# EAGLE design Xadow-NFC-v2 (EAGLE 6.4)
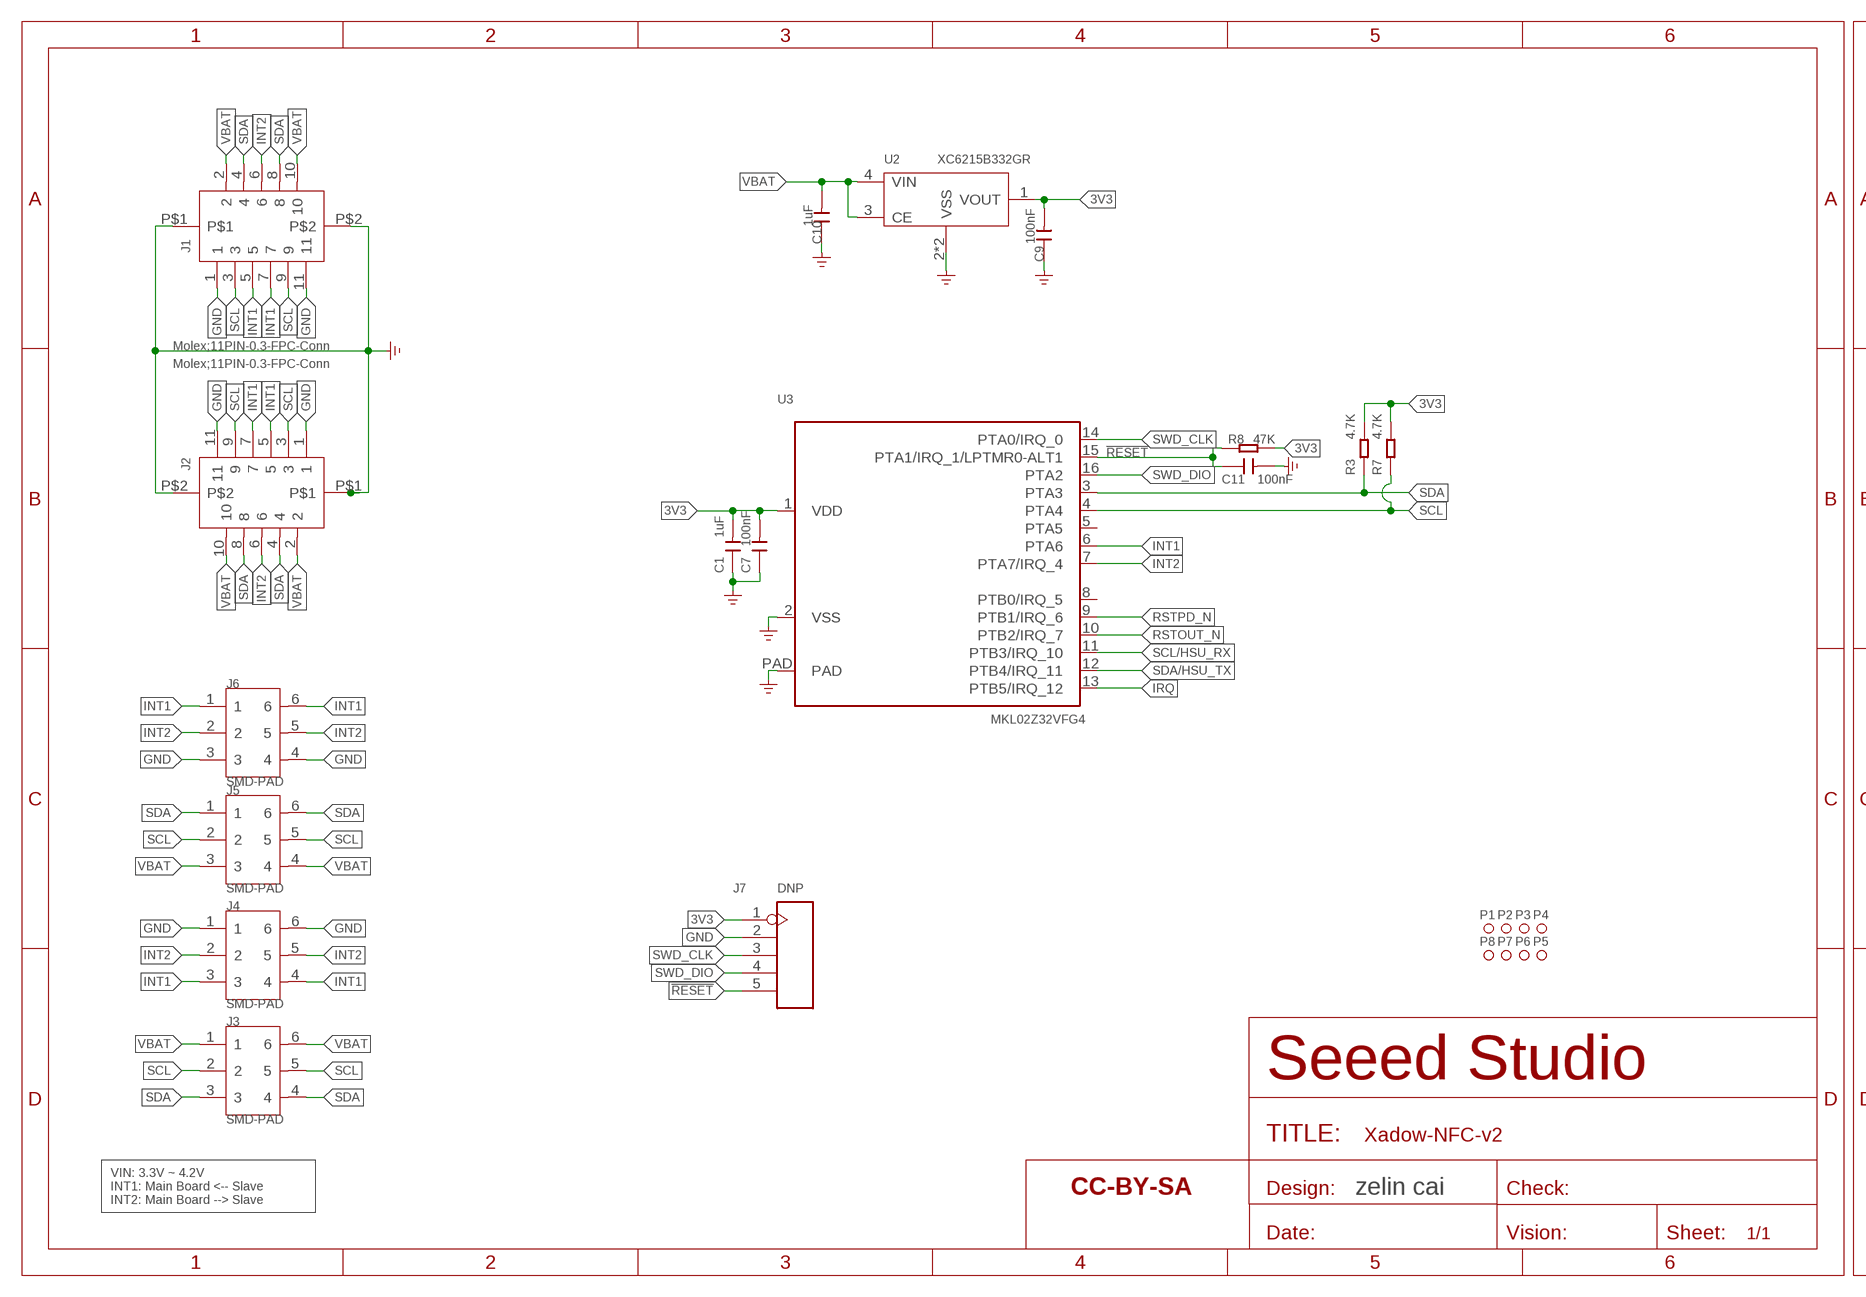
[diagram p0: schematic, sheet 1, part 1 of 2]
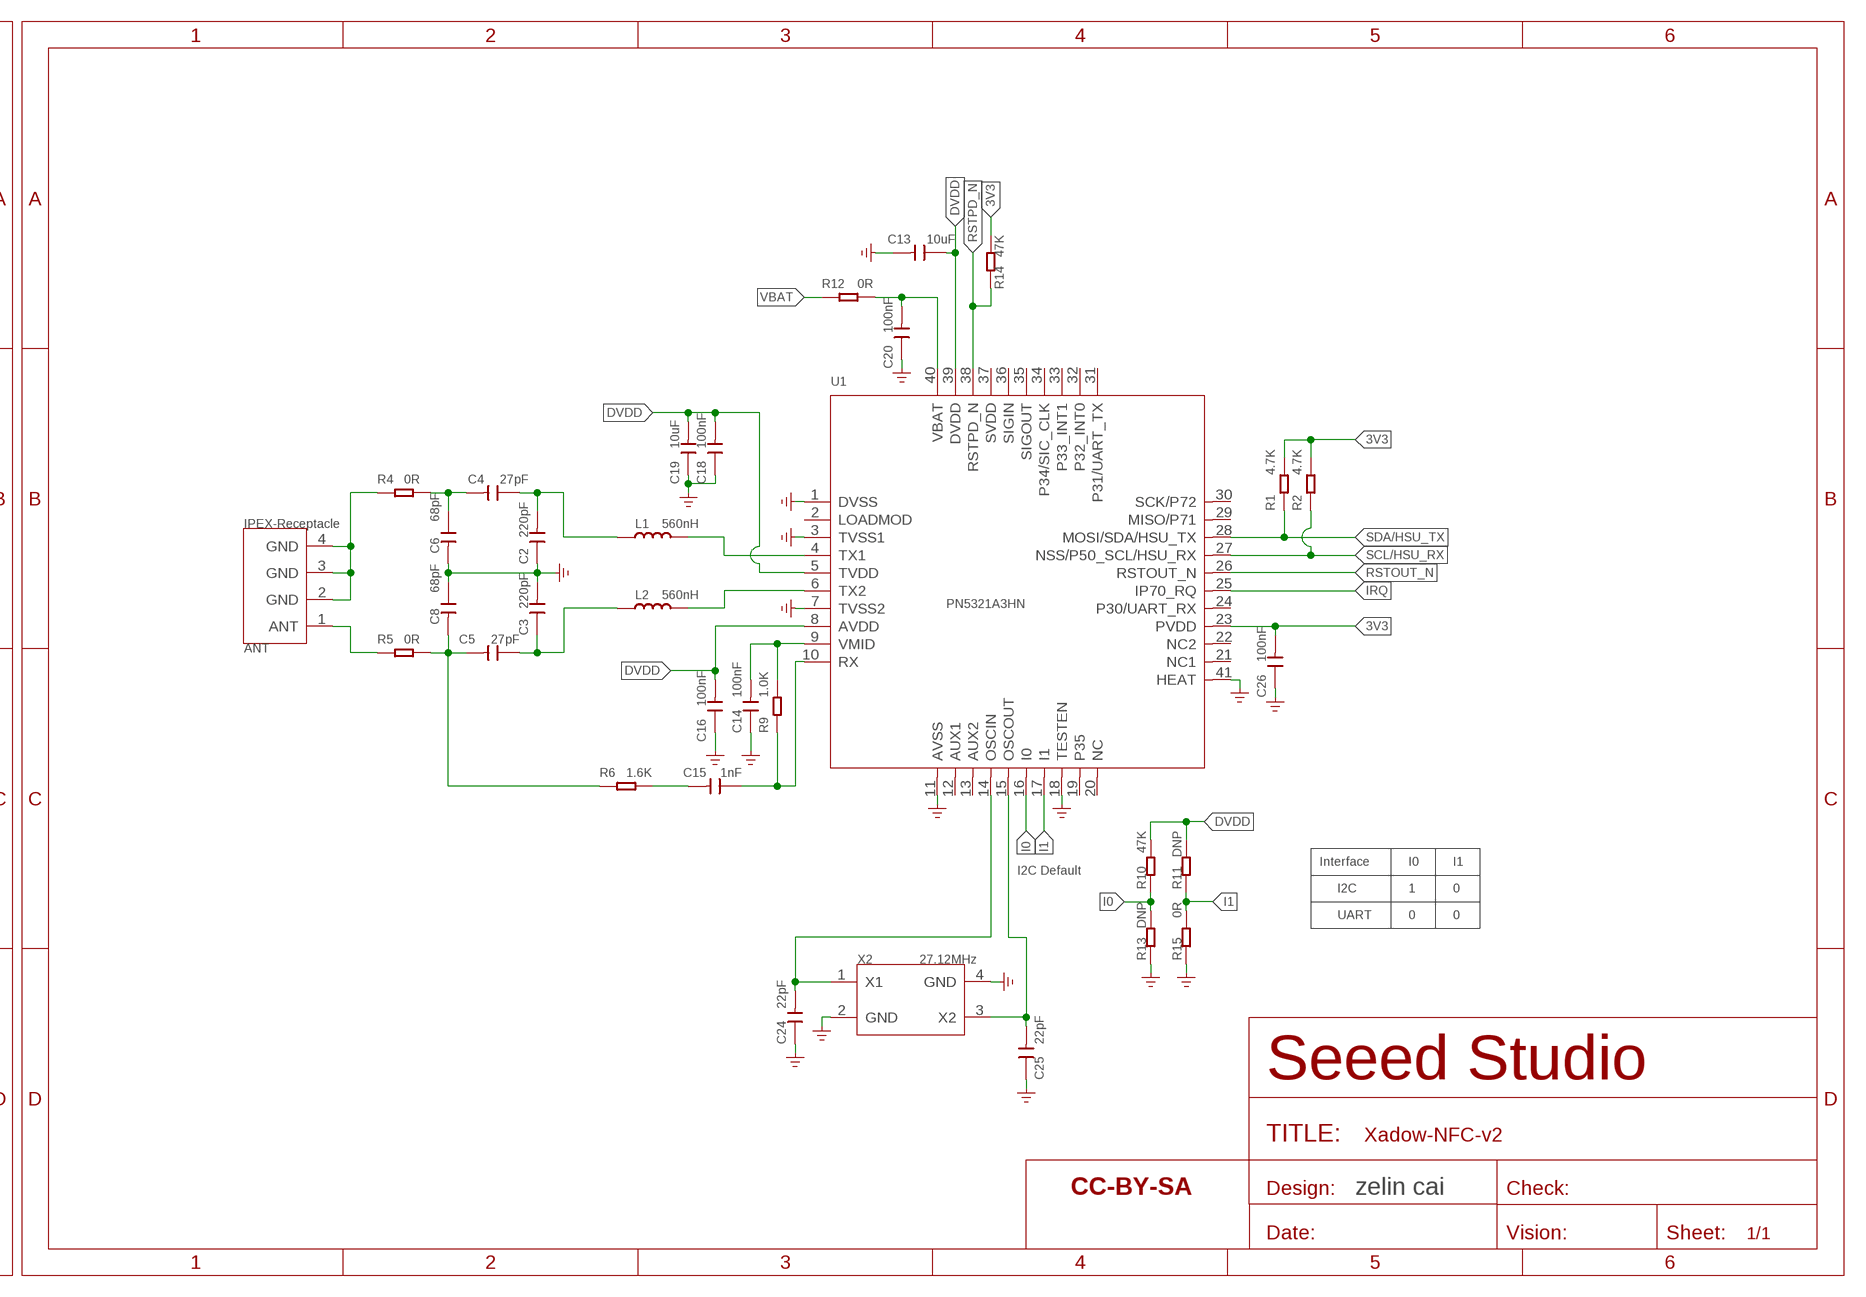
[diagram p1: schematic, sheet 1, part 2 of 2]

## Parts
ANT  IPEX-Receptacle  ANT_IPEX  [ANT-IPEX4-1.7X1.7MM]
C1  1uF  CAP-0402  [C0402]
C2  220pF  CAP-0402  [C0402]
C3  220pF  CAP-0402  [C0402]
C4  27pF  CAP-0402  [C0402]
C5  27pF  CAP-0402  [C0402]
C6  68pF  CAP-0402  [C0402]
C7  100nF  CAP-0402  [C0402]
C8  68pF  CAP-0402  [C0402]
C9  100nF  CAP-0402  [C0402]
C10  1uF  CAP-0402  [C0402]
C11  100nF  CAP-0402  [C0402]
C13  10uF  CAP-0402  [C0402]
C14  100nF  CAP-0402  [C0402]
C15  1nF  CAP-0402  [C0402]
C16  100nF  CAP-0402  [C0402]
C18  100nF  CAP-0402  [C0402]
C19  10uF  CAP-0402  [C0402]
C20  100nF  CAP-0402  [C0402]
C24  22pF  CAP-0402  [C0402]
C25  22pF  CAP-0402  [C0402]
C26  100nF  CAP-0402  [C0402]
J1  Molex;11PIN-0.3-FPC-Conn  FPC-CONNECTER-11P(FH35C-11S-0.3SHW(50))  [FPC11-SMD-0.3(FH35C)]
J2  Molex;11PIN-0.3-FPC-Conn  FPC-CONNECTER-11P(FH35C-11S-0.3SHW(50))  [FPC11-SMD-0.3(FH35C)]
J3  SMD-PAD  HEADER6_S3  [6P-DIP-2_S3]
J4  SMD-PAD  HEADER6_ROUND  [6P-DIP-2_ROUND]
J5  SMD-PAD  HEADER6  [6P-DIP-2]
J6  SMD-PAD  HEADER6_ROUND  [6P-DIP-2_ROUND]
J7  DNP  HEADER-5P'TEST'  [H5-SMD-2.0-TEST]
L1  560nH  INDUCTOR/FERRITE-BEAD'0603'  [L0603]
L2  560nH  INDUCTOR/FERRITE-BEAD'0603'  [L0603]
P1  MRK  MARK-1.0'ANNULAR'  [ROUND-MARK-1.0]
P2  MRK  MARK-1.0'ANNULAR'  [ROUND-MARK-1.0]
P3  MRK  MARK-1.0'ANNULAR'  [ROUND-MARK-1.0]
P4  MRK  MARK-1.0'ANNULAR'  [ROUND-MARK-1.0]
P5  MRK  MARK-1.0'ANNULAR'  [ROUND-MARK-1.0]
P6  MRK  MARK-1.0'ANNULAR'  [ROUND-MARK-1.0]
P7  MRK  MARK-1.0'ANNULAR'  [ROUND-MARK-1.0]
P8  MRK  MARK-1.0'ANNULAR'  [ROUND-MARK-1.0]
R1  4.7K  RES-0402  [R0402]
R2  4.7K  RES-0402  [R0402]
R3  4.7K  RES-0402  [R0402]
R4  0R  RES-0402  [R0402]
R5  0R  RES-0402  [R0402]
R6  1.6K  RES-0402  [R0402]
R7  4.7K  RES-0402  [R0402]
R8  47K  RES-0402  [R0402]
R9  1.0K  RES-0402  [R0402]
R10  47K  RES-0402  [R0402]
R11  DNP  RES-0402  [R0402]
R12  0R  RES-0402  [R0402]
R13  DNP  RES-0402  [R0402]
R14  47K  RES-0402  [R0402]
R15  0R  RES-0402  [R0402]
U1  PN5321A3HN  RF-PN5321A3HN/C106,55  [QFN40G-0.5-6X6MM]
U2  XC6215B332GR  PMIC-XC6215-3V3  [USP4-0.6-1.2X1.6MM]
U3  MKL02Z32VFG4  CONTROLLER-MKL02ZXXVFG4  [QFN16G-0.5-3X3MM]
U$1  PAGE1  SEEEDSTUDIO-OPEN-SCH-FRAME  [SEEEDSTUDIO-PCB-FRAME]
U$21  PAGE2  SEEEDSTUDIO-OPEN-SCH-FRAME  [SEEEDSTUDIO-PCB-FRAME]
X2  27.12MHz  CRYSTALS-4P(T384)  [SMD4P-2.0X1.6X0.5MM]

## Nets
3V3: C1.2 C7.2 C9.2 C26.2 J7.1 R1.2 R2.2 R3.2 R7.2 R8.2 R14.2 U1.23(PVDD) U2.1(VOUT) U3.1(VDD)
!RESET: C11.1 J7.5 R8.1 U3.15(PTA1/IRQ_1/LPTMR0-ALT1)
DVDD: C13.1 C16.2 C18.2 C19.2 R10.1 R11.1 U1.5(TVDD) U1.8(AVDD) U1.39(DVDD)
GND: C1.1 C2.1 C3.2 C6.2 C7.1 C8.1 C9.1 C10.1 C11.2 C13.2 C14.1 C16.1 C18.1 C19.1 C20.1 C24.1 C25.1 C26.1 J1.1 J1.11 J1.P$1 J1.P$2 J2.1 J2.11 J2.P$1 J2.P$2 J4.1 J4.6 J6.3 J6.4 J7.2 R13.2 R15.2 U1.1(DVSS) U1.3(TVSS1) U1.7(TVSS2) U1.11(AVSS) U1.18(TESTEN) U1.41(HEAT) U2.2(VSS) U2.PAD(VSS) U3.2(VSS) U3.PAD X2.2(GND) X2.4(GND) ; supply symbol labelled GND_POWER
I0: R10.2 R13.1 U1.16(I0)
I1: R11.2 R15.1 U1.17(I1)
INT1: J1.5 J1.7 J2.5 J2.7 J4.3 J4.4 J6.1 J6.6 U3.6(PTA6)
INT2: J1.6 J2.6 J4.2 J4.5 J6.2 J6.5 U3.7(PTA7/IRQ_4)
IRQ: U1.25(IP70_RQ) U3.13(PTB5/IRQ_12)
N$1: C15.1 R9.1 U1.10(RX)
N$2: C14.2 R9.2 U1.9(VMID)
N$5: C3.1 C5.1 L2.1
N$6: C2.2 C4.1 L1.1
N$9: C4.2 C6.1 R4.2
N$10: C5.2 C8.2 R5.2 R6.1
N$11: ANT.2(GND) ANT.3(GND) ANT.4(GND) R4.1
N$12: ANT.1(ANT) R5.1
N$13: C15.2 R6.2
N$14: C24.2 U1.14(OSCIN) X2.1(X1)
N$15: C25.2 U1.15(OSCOUT) X2.3(X2)
RSTOUT_N: U1.26(RSTOUT_N) U3.10(PTB2/IRQ_7)
RSTPD_N: R14.1 U1.38(RSTPD_N) U3.9(PTB1/IRQ_6)
SCL: J1.3 J1.9 J2.3 J2.9 J3.2 J3.5 J5.2 J5.5 R7.1 U3.4(PTA4)
SCL/HSU_RX: R2.1 U1.27(NSS/P50_SCL/HSU_RX) U3.11(PTB3/IRQ_10)
SDA: J1.4 J1.8 J2.4 J2.8 J3.3 J3.4 J5.1 J5.6 R3.1 U3.3(PTA3)
SDA/HSU_TX: R1.1 U1.28(MOSI/SDA/HSU_TX) U3.12(PTB4/IRQ_11)
SWD_CLK: J7.3 U3.14(PTA0/IRQ_0)
SWD_DIO: J7.4 U3.16(PTA2)
TX_N: L1.2 U1.4(TX1)
TX_P: L2.2 U1.6(TX2)
VBAT: C10.2 C20.2 J1.2 J1.10 J2.2 J2.10 J3.1 J3.6 J5.3 J5.4 R12.1 R12.2 U1.40(VBAT) U2.3(CE) U2.4(VIN)
Unconnected: U1.2(LOADMOD) U1.12(AUX1) U1.13(AUX2) U1.19(P35) U1.20(NC) U1.21(NC1) U1.22(NC2) U1.24(P30/UART_RX) U1.29(MISO/P71) U1.30(SCK/P72) U1.31(P31/UART_TX) U1.32(P32_INT0) U1.33(P33_INT1) U1.34(P34/SIC_CLK) U1.35(SIGOUT) U1.36(SIGIN) U1.37(SVDD) U3.5(PTA5) U3.8(PTB0/IRQ_5)

## Notes on the sheet
- Interface | I0 | I1
- I2C Default
- I2C | 1 | 0
- UART | 0 | 0
- zelin cai | zelin cai
- VIN: 3.3V ~ 4.2V
  INT1: Main Board <-- Slave
  INT2: Main Board --> Slave

## Library data of the parts
ANT = template:ANT_IPEX
C1-C11 C13-C16 C18-C20 C24-C26 = Discrete-new:CAP: Ceramic Capacitors
J1 J2 = template:FPC-CONNECTER-11P(FH35C-11S-0.3SHW(50))
J3 = Connector:HEADER6_S3
J4 J6 = template:HEADER6_ROUND
J5 = template:HEADER6
J7 = Connector-new:HEADER-5P
L1 L2 = Discrete-new:INDUCTOR/FERRITE-BEAD
P1-P8 = Discrete-new:MARK-1.0; PARTNO: DNP
R1-R15 = Discrete-new:RES
U1 = IC-new:RF-PN5321A3HN/C106,55: 310060004
U2 = IC-new:PMIC-XC6215-3V3
U3 = IC-new:CONTROLLER-MKL02ZXXVFG4; MPN: MKL02ZxxVFG4
U$1 U$21 = moudle-new:SEEEDSTUDIO-OPEN-SCH-FRAME
X2 = template:CRYSTALS-4P(T384)

## Board
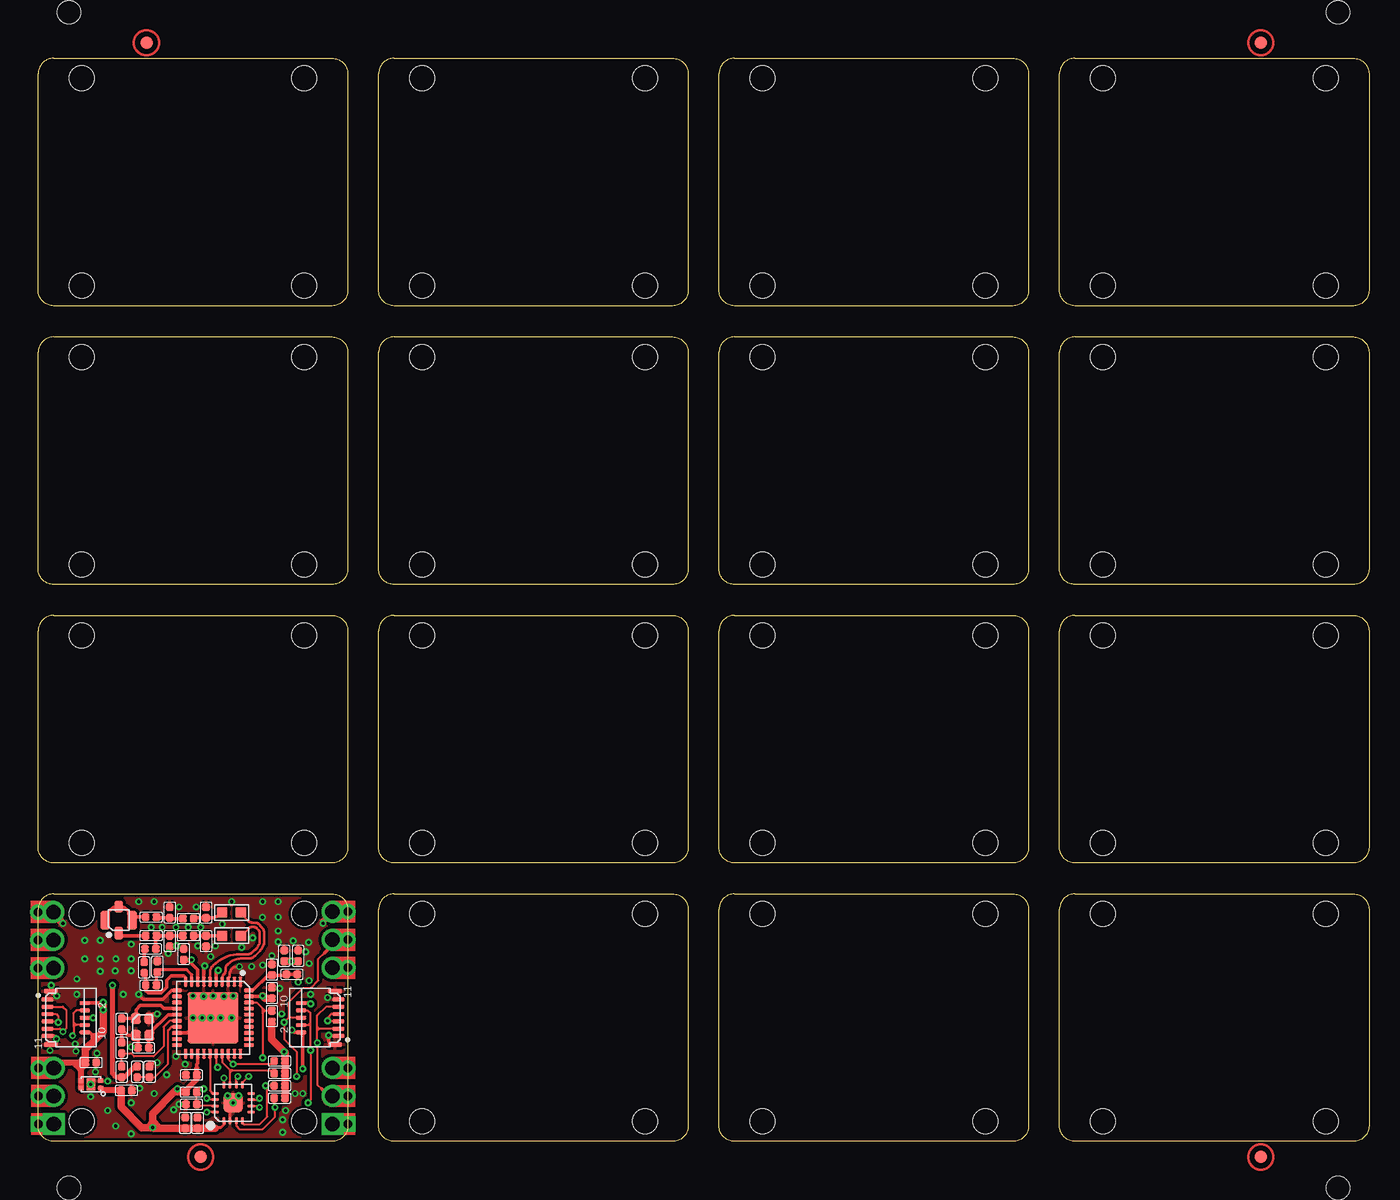
[diagram p2: board, top side]
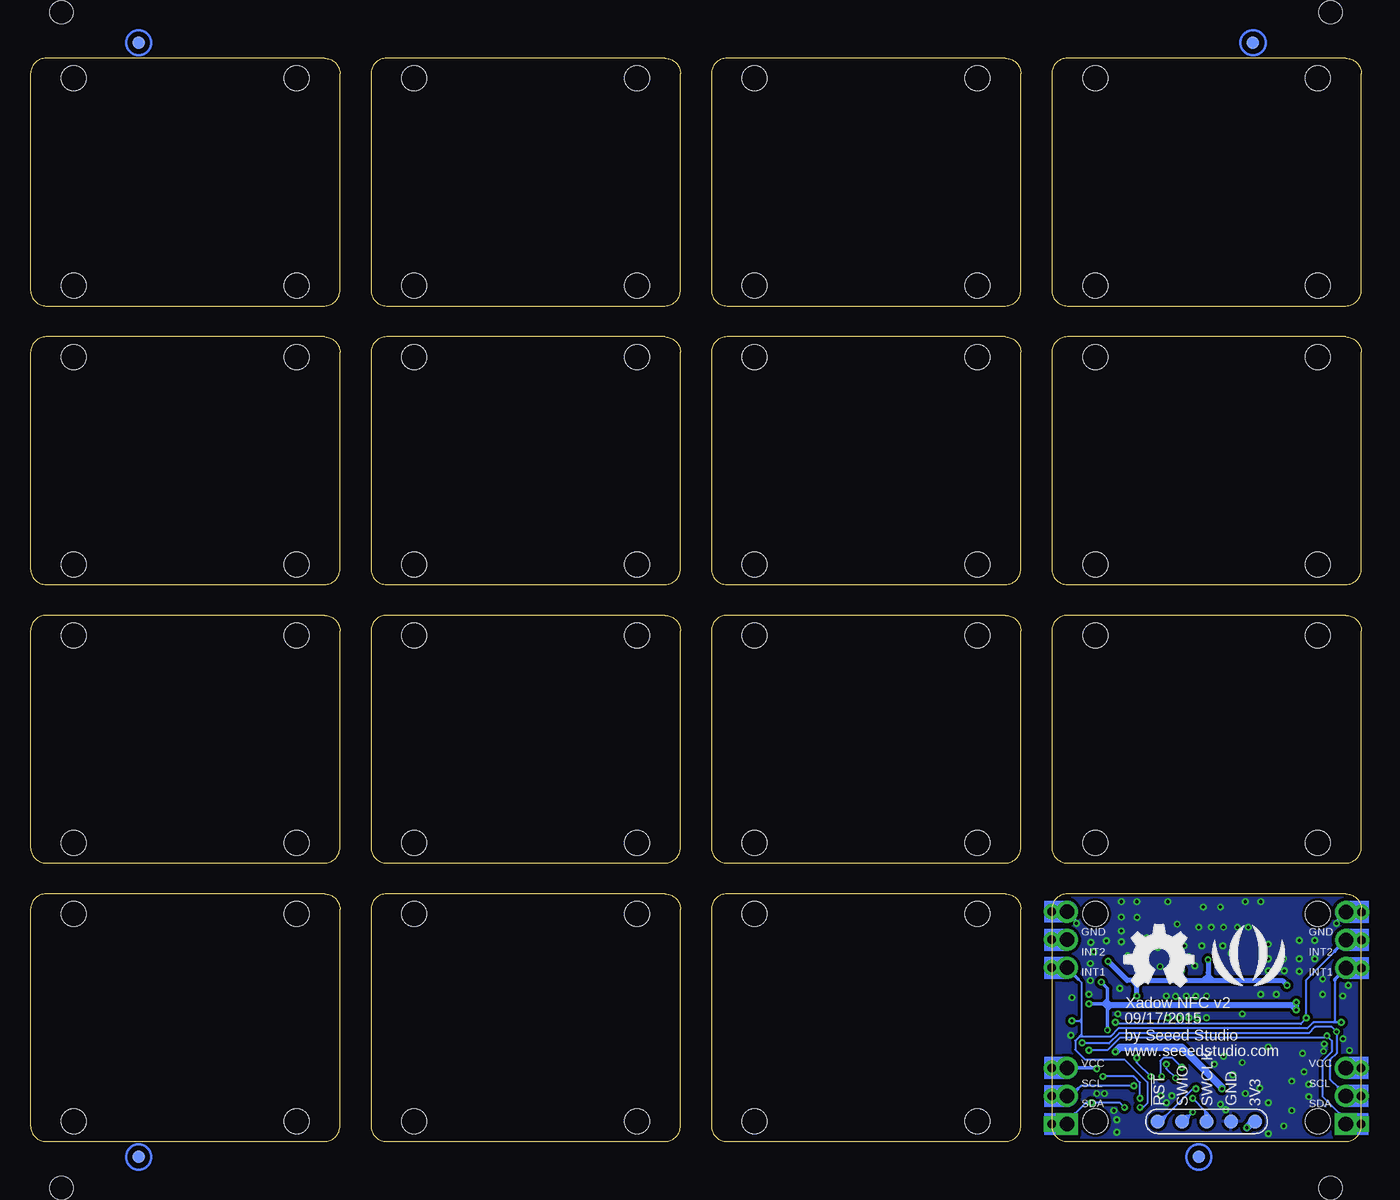
[diagram p3: board, bottom side, seen from below]

Size 109.22 x 88.9 mm. Coordinates in mm from the lower left corner, seen from the top.
Outline: 1.27,0 arc-90 0,1.27
Outline: 24.13,20.32 arc-90 25.4,19.05
Outline: 25.4,1.27 arc-90 24.13,0
Outline: 24.13,0 1.27,0
Outline: 1.27,0 arc-90 0,1.27
Outline: 0,1.27 0,19.05 arc-90 1.27,20.32 24.13,20.32
Outline: 24.13,20.32 arc-90 25.4,19.05
Outline: 25.4,1.27 arc-90 24.13,0
Outline: 25.4,19.05 25.4,1.27
Outline: 29.21,0 arc-90 27.94,1.27
Outline: 52.07,20.32 arc-90 53.34,19.05
Outline: 53.34,1.27 arc-90 52.07,0
Outline: 52.07,0 29.21,0
Outline: 29.21,0 arc-90 27.94,1.27
Outline: 27.94,1.27 27.94,19.05 arc-90 29.21,20.32 52.07,20.32
Outline: 52.07,20.32 arc-90 53.34,19.05
Outline: 53.34,1.27 arc-90 52.07,0
Outline: 53.34,19.05 53.34,1.27
Outline: 1.27,22.86 arc-90 0,24.13
Outline: 24.13,43.18 arc-90 25.4,41.91
Outline: 25.4,24.13 arc-90 24.13,22.86
Outline: 24.13,22.86 1.27,22.86
Outline: 1.27,22.86 arc-90 0,24.13
Outline: 0,24.13 0,41.91 arc-90 1.27,43.18 24.13,43.18
Outline: 24.13,43.18 arc-90 25.4,41.91
Outline: 25.4,24.13 arc-90 24.13,22.86
Outline: 25.4,41.91 25.4,24.13
Outline: 29.21,22.86 arc-90 27.94,24.13
Outline: 52.07,43.18 arc-90 53.34,41.91
Outline: 53.34,24.13 arc-90 52.07,22.86
Outline: 52.07,22.86 29.21,22.86
Outline: 29.21,22.86 arc-90 27.94,24.13
Outline: 27.94,24.13 27.94,41.91 arc-90 29.21,43.18 52.07,43.18
Outline: 52.07,43.18 arc-90 53.34,41.91
Outline: 53.34,24.13 arc-90 52.07,22.86
Outline: 53.34,41.91 53.34,24.13
Outline: 57.15,0 arc-90 55.88,1.27
Outline: 80.01,20.32 arc-90 81.28,19.05
Outline: 81.28,1.27 arc-90 80.01,0
Outline: 80.01,0 57.15,0
Outline: 57.15,0 arc-90 55.88,1.27
Outline: 55.88,1.27 55.88,19.05 arc-90 57.15,20.32 80.01,20.32
Outline: 80.01,20.32 arc-90 81.28,19.05
Outline: 81.28,1.27 arc-90 80.01,0
Outline: 81.28,19.05 81.28,1.27
Outline: 85.09,0 arc-90 83.82,1.27
Outline: 107.95,20.32 arc-90 109.22,19.05
Outline: 109.22,1.27 arc-90 107.95,0
Outline: 107.95,0 85.09,0
Outline: 85.09,0 arc-90 83.82,1.27
Outline: 83.82,1.27 83.82,19.05 arc-90 85.09,20.32 107.95,20.32
Outline: 107.95,20.32 arc-90 109.22,19.05
Outline: 109.22,1.27 arc-90 107.95,0
Outline: 109.22,19.05 109.22,1.27
Outline: 57.15,22.86 arc-90 55.88,24.13
Outline: 80.01,43.18 arc-90 81.28,41.91
Outline: 81.28,24.13 arc-90 80.01,22.86
Outline: 80.01,22.86 57.15,22.86
Outline: 57.15,22.86 arc-90 55.88,24.13
Outline: 55.88,24.13 55.88,41.91 arc-90 57.15,43.18 80.01,43.18
Outline: 80.01,43.18 arc-90 81.28,41.91
Outline: 81.28,24.13 arc-90 80.01,22.86
Outline: 81.28,41.91 81.28,24.13
Outline: 85.09,22.86 arc-90 83.82,24.13
Outline: 107.95,43.18 arc-90 109.22,41.91
Outline: 109.22,24.13 arc-90 107.95,22.86
Outline: 107.95,22.86 85.09,22.86
Outline: 85.09,22.86 arc-90 83.82,24.13
Outline: 83.82,24.13 83.82,41.91 arc-90 85.09,43.18 107.95,43.18
Outline: 107.95,43.18 arc-90 109.22,41.91
Outline: 109.22,24.13 arc-90 107.95,22.86
Outline: 109.22,41.91 109.22,24.13
Outline: 1.27,45.72 arc-90 0,46.99
Outline: 24.13,66.04 arc-90 25.4,64.77
Outline: 25.4,46.99 arc-90 24.13,45.72
Outline: 24.13,45.72 1.27,45.72
Outline: 1.27,45.72 arc-90 0,46.99
Outline: 0,46.99 0,64.77 arc-90 1.27,66.04 24.13,66.04
Outline: 24.13,66.04 arc-90 25.4,64.77
Outline: 25.4,46.99 arc-90 24.13,45.72
Outline: 25.4,64.77 25.4,46.99
Outline: 29.21,45.72 arc-90 27.94,46.99
Outline: 52.07,66.04 arc-90 53.34,64.77
Outline: 53.34,46.99 arc-90 52.07,45.72
Outline: 52.07,45.72 29.21,45.72
Outline: 29.21,45.72 arc-90 27.94,46.99
Outline: 27.94,46.99 27.94,64.77 arc-90 29.21,66.04 52.07,66.04
Outline: 52.07,66.04 arc-90 53.34,64.77
Outline: 53.34,46.99 arc-90 52.07,45.72
Outline: 53.34,64.77 53.34,46.99
Outline: 1.27,68.58 arc-90 0,69.85
Outline: 24.13,88.9 arc-90 25.4,87.63
Outline: 25.4,69.85 arc-90 24.13,68.58
Outline: 24.13,68.58 1.27,68.58
Outline: 1.27,68.58 arc-90 0,69.85
Outline: 0,69.85 0,87.63 arc-90 1.27,88.9 24.13,88.9
Outline: 24.13,88.9 arc-90 25.4,87.63
Outline: 25.4,69.85 arc-90 24.13,68.58
Outline: 25.4,87.63 25.4,69.85
Outline: 29.21,68.58 arc-90 27.94,69.85
Outline: 52.07,88.9 arc-90 53.34,87.63
Outline: 53.34,69.85 arc-90 52.07,68.58
Outline: 52.07,68.58 29.21,68.58
Outline: 29.21,68.58 arc-90 27.94,69.85
Outline: 27.94,69.85 27.94,87.63 arc-90 29.21,88.9 52.07,88.9
Outline: 52.07,88.9 arc-90 53.34,87.63
Outline: 53.34,69.85 arc-90 52.07,68.58
Outline: 53.34,87.63 53.34,69.85
Outline: 57.15,45.72 arc-90 55.88,46.99
Outline: 80.01,66.04 arc-90 81.28,64.77
Outline: 81.28,46.99 arc-90 80.01,45.72
Outline: 80.01,45.72 57.15,45.72
Outline: 57.15,45.72 arc-90 55.88,46.99
Outline: 55.88,46.99 55.88,64.77 arc-90 57.15,66.04 80.01,66.04
Outline: 80.01,66.04 arc-90 81.28,64.77
Outline: 81.28,46.99 arc-90 80.01,45.72
Outline: 81.28,64.77 81.28,46.99
Outline: 85.09,45.72 arc-90 83.82,46.99
Outline: 107.95,66.04 arc-90 109.22,64.77
Outline: 109.22,46.99 arc-90 107.95,45.72
Outline: 107.95,45.72 85.09,45.72
Outline: 85.09,45.72 arc-90 83.82,46.99
Outline: 83.82,46.99 83.82,64.77 arc-90 85.09,66.04 107.95,66.04
Outline: 107.95,66.04 arc-90 109.22,64.77
Outline: 109.22,46.99 arc-90 107.95,45.72
Outline: 109.22,64.77 109.22,46.99
Outline: 57.15,68.58 arc-90 55.88,69.85
Outline: 80.01,88.9 arc-90 81.28,87.63
Outline: 81.28,69.85 arc-90 80.01,68.58
Outline: 80.01,68.58 57.15,68.58
Outline: 57.15,68.58 arc-90 55.88,69.85
Outline: 55.88,69.85 55.88,87.63 arc-90 57.15,88.9 80.01,88.9
Outline: 80.01,88.9 arc-90 81.28,87.63
Outline: 81.28,69.85 arc-90 80.01,68.58
Outline: 81.28,87.63 81.28,69.85
Outline: 85.09,68.58 arc-90 83.82,69.85
Outline: 107.95,88.9 arc-90 109.22,87.63
Outline: 109.22,69.85 arc-90 107.95,68.58
Outline: 107.95,68.58 85.09,68.58
Outline: 85.09,68.58 arc-90 83.82,69.85
Outline: 83.82,69.85 83.82,87.63 arc-90 85.09,88.9 107.95,88.9
Outline: 107.95,88.9 arc-90 109.22,87.63
Outline: 109.22,69.85 arc-90 107.95,68.58
Outline: 109.22,87.63 109.22,69.85
Copper layers (1*16): Top 0.035mm / dielectric 1.5mm / Bottom 0.035mm
Design rules "SeeedStudio_2layer_DRU_no_angle_20140221 *": minimum track width 6mil, minimum drill 10mil, track to track 6mil, track to pad 6mil, pad to pad 6mil, via to via 6mil, smd to smd 0mil, copper to edge 10mil, drill to drill 10mil, minimum pad ring 10mil, minimum via ring 6mil, stop-mask expansion 2mil, vias tented up to drill 25mil, thermal gap 10mil
Holes 2.03 mm at 3.56,18.67 21.84,18.67 21.84,1.65 3.56,1.65 49.78,1.65 49.78,18.67 31.5,18.67 31.5,1.65 21.84,24.51 21.84,41.53 3.56,41.53 3.56,24.51 49.78,24.51 49.78,41.53 31.5,41.53 31.5,24.51 77.72,1.65 77.72,18.67 59.44,18.67 59.44,1.65 105.66,1.65 105.66,18.67 87.38,18.67 87.38,1.65 77.72,24.51 77.72,41.53 59.44,41.53 59.44,24.51 105.66,24.51 105.66,41.53 87.38,41.53 87.38,24.51 21.84,47.37 21.84,64.39 3.56,64.39 3.56,47.37 49.78,47.37 49.78,64.39 31.5,64.39 31.5,47.37 21.84,70.23 21.84,87.25 3.56,87.25 3.56,70.23 49.78,70.23 49.78,87.25 31.5,87.25 31.5,70.23 77.72,47.37 77.72,64.39 59.44,64.39 59.44,47.37 105.66,47.37 105.66,64.39 87.38,64.39 87.38,47.37 77.72,70.23 77.72,87.25 59.44,87.25 59.44,70.23 105.66,70.23 105.66,87.25 87.38,87.25 87.38,70.23
Holes 1.91 mm at 2.54,-3.81 106.68,-3.81 106.68,92.71 2.54,92.71

### Footprints (pad centres in the part's own frame; a part is rotated, then mirrored left to right if it is on the bottom)
ANT-IPEX4-1.7X1.7MM = smd 0.7 x 1.05: 1 0,-1.075 | smd 0.8 x 1.5: 2 1.1,0; 4 -1.1,0 | smd 0.7 x 0.95: 3 0,1.125
C0402 = smd 0.635 x 0.635: 1 0,0.445; 2 0,-0.445
FPC11-SMD-0.3(FH35C) = smd 0.3 x 1: 1 -1.5,-3.075; 3 -0.9,-3.075; 5 -0.3,-3.075; 7 0.3,-3.075; 9 0.9,-3.075; 11 1.5,-3.075 | smd 0.3 x 0.85: 2 -1.2,0; 4 -0.6,0; 6 0,0; 8 0.6,0; 10 1.2,0 | smd 0.4 x 1.15: P$1 2.2,-2.8; P$2 -2.2,-2.8
6P-DIP-2_S3 = drill 0.7 pad 1.27: 1 -2.3,0; 2 0,0 | drill 0.7 pad 1.27 square: 3 2.3,0 | drill 1.2 pad 1.8 square: 4 2.3,1.25 | drill 1.2 pad 1.8: 5 0,1.25; 6 -2.3,1.25
6P-DIP-2_ROUND = drill 0.7 pad 1.27: 1 -2.3,0; 2 0,0; 3 2.3,0 | drill 1.2 pad 1.8: 4 2.3,1.25; 5 0,1.25; 6 -2.3,1.25
6P-DIP-2 = drill 0.7 pad 1.27 square: 1 -2.3,0 | drill 0.7 pad 1.27: 2 0,0; 3 2.3,0 | drill 1.2 pad 1.8: 4 2.3,1.25; 5 0,1.25 | drill 1.2 pad 1.8 square: 6 -2.3,1.25
H5-SMD-2.0-TEST = smd 1.143 x 1.143: 1 0,4; 2 0,2; 3 0,0; 4 0,-2; 5 0,-4
L0603 = smd 0.889 x 0.889: 1 -0.762,0; 2 0.762,0
ROUND-MARK-1.0 = smd 1.016 x 1.016: P$1 0,0
R0402 = smd 0.635 x 0.635: 1 0,0.445; 2 0,-0.445
QFN40G-0.5-6X6MM = smd 0.8 x 0.3: 1 -2.95,2.25; 2 -2.95,1.75; 3 -2.95,1.25; 4 -2.95,0.75; 5 -2.95,0.25; 6 -2.95,-0.25; 7 -2.95,-0.75; 8 -2.95,-1.25; 9 -2.95,-1.75; 10 -2.95,-2.25; 21 2.95,-2.25; 22 2.95,-1.75; 23 2.95,-1.25; 24 2.95,-0.75; 25 2.95,-0.25; 26 2.95,0.25; 27 2.95,0.75; 28 2.95,1.25; 29 2.95,1.75; 30 2.95,2.25 | smd 0.3 x 0.8: 11 -2.25,-2.95; 12 -1.75,-2.95; 13 -1.25,-2.95; 14 -0.75,-2.95; 15 -0.25,-2.95; 16 0.25,-2.95; 17 0.75,-2.95; 18 1.25,-2.95; 19 1.75,-2.95; 20 2.25,-2.95; 31 2.25,2.95; 32 1.75,2.95; 33 1.25,2.95; 34 0.75,2.95; 35 0.25,2.95; 36 -0.25,2.95; 37 -0.75,2.95; 38 -1.25,2.95; 39 -1.75,2.95; 40 -2.25,2.95 | smd 4.2 x 4.2: 41 0,0
USP4-0.6-1.2X1.6MM = smd 0.36 x 0.4: 1 -0.3,-0.8; 2 0.3,-0.8; 3 0.3,0.8; 4 -0.3,0.8 | smd 1 x 0.7: PAD 0,0
QFN16G-0.5-3X3MM = smd 0.6 x 0.25: 1 -1.475,0.75; 2 -1.475,0.25; 3 -1.475,-0.25; 4 -1.475,-0.75; 9 1.475,-0.75; 10 1.475,-0.25; 11 1.475,0.25; 12 1.475,0.75 | smd 0.25 x 0.6: 5 -0.75,-1.475; 6 -0.25,-1.475; 7 0.25,-1.475; 8 0.75,-1.475; 13 0.75,1.475; 14 0.25,1.475; 15 -0.25,1.475; 16 -0.75,1.475 | smd 1.6 x 1.6: PAD 0,0
SMD4P-2.0X1.6X0.5MM = smd 0.9 x 0.8: 1 -0.7,-0.55; 2 0.7,-0.55; 3 0.7,0.55; 4 -0.7,0.55

### Placement (x,y rotation side)
ANT  6.6,18.16 0 top
C1  12.06,1.52 0 top
C2  13.78,18.8 0 top
C3  13.78,16.45 0 top
C4  12.32,18.29 270 top
C5  12.32,16.89 270 top
C6  10.79,18.8 180 top
C7  13.08,1.52 0 top
C8  10.79,16.45 180 top
C9  7.24,4.19 270 top
C10  4.32,6.48 270 top
C11  12.57,3.05 270 top
C13  19.18,12.19 180 top
C14  9.78,14.35 0 top
C15  8.7,14.29 180 top
C16  11.94,15.37 0 top
C18  20.19,15.24 0 top
C19  21.34,15.24 0 top
C20  19.18,14.1 0 top
C24  6.86,9.65 180 top
C25  8.64,7.68 90 top
C26  12.57,5.46 90 top
J1  21.56,10.16 90 top
J2  3.84,10.16 270 top
J3  0.03,3.73 270 top
J4  0,16.54 270 top
J5  25.4,3.73 90 top
J6  25.4,16.56 90 top
J7  12.7,1.65 270 bottom
L1  15.88,18.8 0 top
L2  15.88,16.89 0 top
P1  13.34,-1.27 90 top
P2  13.34,-1.27 270 bottom
P3  100.33,-1.27 90 top
P4  100.33,-1.27 270 bottom
P5  8.89,90.17 90 top
P6  8.89,90.17 270 bottom
P7  100.33,90.17 90 top
P8  100.33,90.17 270 bottom
R1  19.81,6.6 90 top
R2  19.81,5.59 90 top
R3  19.81,3.56 90 top
R4  9.27,18.41 90 top
R5  9.27,16.89 90 top
R6  9.21,15.81 270 top
R7  19.81,4.57 90 top
R8  12.57,4.06 270 top
R9  9.27,12.83 90 top
R10  6.86,5.71 180 top
R11  8.13,5.71 0 top
R12  20.83,13.72 270 top
R13  6.86,7.68 180 top
R14  19.18,10.29 0 top
R15  9.14,5.71 180 top
U1  14.35,10.16 270 top
U2  4.32,4.7 90 top
U3  16,3.17 90 top
U$1  0.13,-36.32 0 top  (outside the outline)
U$21  1.91,-27.3 0 top  (outside the outline)
U$27  [OSHW_FILLX200_NOTEXT]  19.43,12.7 0 bottom
U$29  [SEEED-SILK-280*268MIL]  9.27,14.48 0 bottom
X2  8.57,9.4 270 top

### Tracks (layer width: path | path; a pad name or v marks a point on that pad's centre or on a via)
3V3  (via drill 0.25 pad 0.51)
  Top 0.254: U3.1 15.25,1.41 14.99,1.14 14.61,1.14 14.54,1.08
  Top 0.305: U1.23 13.1,6.43 13.02,6.35 13.02,6.03
  Top 0.406: 13.02,6.03 C26.2 13.02,5.12 12.13,4.23 R8.2
  Top 0.508: C9.2 5.33,4.19 U2.1
  Top 0.61: R3.2 R7.2 R2.2 R1.2 20.26,7.3 v20.19,7.37 19.18,8.38 R14.2 | 14.54,1.08 C7.2 C1.2 9.46,1.08 v9.4,1.14 | C9.2 6.79,2.86 8.51,1.14 9.02,1.14 | R8.2 11.68,4.06 | 11.68,4.06 v11.43,4.32 11.18,4.06 | 11.18,4.06 9.4,2.29 9.4,1.78 9.4,1.65 | 11.68,4.06 11.18,4.06 | 9.02,1.14 v9.4,1.14 | v9.4,1.14 9.4,1.52 | 9.4,1.65 9.4,1.52 | 9.4,1.52 9.02,1.14 | 9.4,1.65 9.91,1.14
  Bottom 0.61: 20.07,7.49 v20.19,7.37 19.81,7.75 14.73,7.75 11.43,4.45 v11.43,4.32 | J7.1 8.89,1.65 v9.4,1.14
!RESET  (via drill 0.25 pad 0.51)
  Top 0.152: U3.15 13.14,2.92 C11.1 R8.1 13.27,4.32 v13.59,4.32
  Bottom 0.152: J7.5 16.51,1.65 16,2.16 | 16,2.16 13.84,4.32 v13.59,4.32 | 16,2.16 16.64,1.91 | 16,2.16 16.38,1.4
DVDD  (via drill 0.25 pad 0.51)
  Top 0.305: U1.39 18.39,11.91 v18.41,11.94 | U1.5 14.6,13.89 v14.76,14.05 | U1.8 13.1,14.08 12.57,14.61 v12.57,14.92
  Top 0.406: C16.2 v12.57,14.92 | R11.1 7.94,6.16 7.05,5.27 R10.1 6.41,5.27 6.1,5.59 v6.1,12.83
  Top 0.61: C19.2 20.79,14.8 v20.78,14.78 20.77,14.8 C18.2 | C13.1 18.61,11.75 v18.41,11.94
  Bottom 0.406: v14.76,14.05 14.78,14.05 14.78,13.66 | 18.03,13.21 15.24,13.21 | 15.24,13.21 14.86,13.21 | 14.86,13.21 14.35,13.21 | 18.03,13.21 18.41,13.21 | 18.41,13.21 18.8,13.21 | 18.8,13.21 19.2,13.21 v20.78,14.78 | v18.41,11.94 18.41,12.83 | 18.41,12.83 18.41,13.21 | 18.41,12.83 18.03,13.21 | 18.41,12.83 18.8,13.21 | 14.78,13.66 14.78,13.57 | 14.78,13.57 14.78,13.28 14.86,13.21 | 14.78,13.57 14.71,13.57 14.35,13.21 | 14.78,13.66 15.24,13.21 | 14.35,13.21 12.95,13.21 | 12.95,13.21 12.57,13.21 | 12.57,13.21 12.19,13.21 | 12.19,13.21 6.48,13.21 v6.1,12.83 | v12.57,14.92 12.57,13.84 12.57,13.59 | 12.57,13.59 12.57,13.21 | 12.57,13.59 12.19,13.21 | 12.57,13.59 12.95,13.21
GND  (via drill 0.25 pad 0.51)
  Top 0.203: v16.51,14.35 16.08,14.35 15.88,14.15 arc45 15.7,13.72 15.7,13.51 15.6,13.42 U1.3
  Top 0.254: U3.2 15.75,2.92 U3.PAD
  Top 0.305: R13.2 C24.1 7.37,8.7 X2.2 8.19,8.53 C25.1 7.68,7.68 v7.62,7.75 | U1.11 10.95,12.41 10.22,11.68 8.64,11.68 v8.26,12.06 | U1.7 13.6,14.36 v13.65,14.41 | X2.4 9.12,10.14 9.45,10.46 v9.75,10.46 | U1.18 12.21,8.91 v13.46,10.16 | J2.11 1.27,8.66 v1.5,8.43 | J2.P$1 1.36,7.96 1.52,8.13 1.52,8.38 | J1.P$2 24.04,7.96 23.82,8.18 v23.82,8.71 23.88,8.66 J1.1 | v9.78,6.48 9.46,6.48 R15.2
  Top 0.508: J2.P$2 1.1,12.36 v1.52,11.94 | v23.37,17.91 23.37,18.08 J6.4 J6.3
  Top 0.61: J4.6 1.25,18.69 v2.03,17.91
  Bottom 0.305: v23.37,17.91 23.37,18.08 J6.4 | v2.03,17.91 2.03,18.05 J4.6
  other vias: 13.34,17.59 12.32,17.59 14.54,16.07 15.11,17.84 11.56,19.24 12.95,19.24 11.3,17.59 10.16,17.59 9.27,17.59 11.37,16.07 6.38,15 7.62,16.19 5.08,16.51 14.16,10.16 16,11.94 14.35,11.94 12.7,11.94 12.7,10.16 23.75,11.81 18.41,19.68 15.88,19.68 9.53,19.68 8.26,19.68 3.81,16.51 5.08,13.97 3.81,14.99 3.17,13.34 13.08,16.07 10.67,15.43 19.68,19.68 3.17,12.06 16.7,15.94 17.59,16.7 18.4,18.4 22.35,12.06 15.88,10.16 19.68,18.41 19.68,16.38 11.56,3.05 7.62,3.17 12.06,6.35 16,3.17 14.16,15.18 4.83,7.24 4.7,5.71 4.32,4.7 5.71,4.95 4.32,3.68 8.32,4.38 6.99,12.06 14.99,10.16 13.59,11.91 15.24,11.91 20.07,1.78 21.72,3.94 11.3,6.99 19.81,12.57 19.18,15.24 18.41,14.48 17.53,14.35 21.95,15.57 22.2,16.33 19.68,17.27 16.45,3.75 15.56,3.75 20.32,2.54 20.07,0.76 21.08,3.94 11.11,2.6 10.54,5.46 5.71,2.54 6.35,1.27 7.62,0.64 3.05,8 19.99,10.46 22.23,14.61 22.23,13.21 3.1,7.42 0.97,7.47 1.07,12.83 5.08,14.99 7.65,15 7.62,14 6.32,14 20.93,16.46 9.53,3.94
  pour Bottom (isolate 0.254, rank 6): -0.64,20.95 26.04,20.95 26.04,-0.64 -0.64,-0.64
  pour Top (isolate 0.254, rank 6): -0.64,20.95 26.04,20.95 26.04,-0.64 -0.64,-0.64
I0
  Top 0.152: U1.16 10.8,9.91 10.29,9.4 10.29,7.8 9.47,6.99 7.87,6.99 7.62,7.24 R13.1 R10.2
I1
  Top 0.152: U1.17 10.93,9.41 10.67,9.14 10.67,6.39 9.54,5.27 R15.1 R11.2
INT1  (via drill 0.25 pad 0.51)
  Top 0.152: J2.7 1.57,9.86 v1.65,9.78 1.65,10.29 1.48,10.46 J2.5 | J1.5 23.8,9.86 v23.75,9.91 23.75,10.16 24.05,10.46 J1.7 | U3.6 18.03,2.92 v18.16,2.79
  Bottom 0.152: J6.6 J6.1 | J4.3 J4.4 | 1.65,13.83 1.66,13.83 | 2.16,13.21 2.16,9.91 | 2.16,9.91 2.16,9.78 | 22.99,10.03 22.99,13.08 23.24,13.34 | 22.99,10.03 22.99,9.91 | 22.99,9.91 22.99,9.78 | 22.99,9.78 22.99,8.76 | v18.16,2.79 17.91,2.79 17.53,3.17 17.53,4.83 19.43,6.73 22.67,6.73 23.47,7.53 23.47,8.28 23.11,8.64 | v1.65,9.78 2.03,9.78 | 2.03,9.78 2.16,9.78 | 2.16,9.78 2.29,9.78 | 2.16,9.91 2.03,9.78 | 2.16,9.91 2.29,9.78 | 23.11,8.64 22.86,8.64 | 22.86,8.64 20.57,8.64 19.94,9.27 4.45,9.27 3.94,9.78 2.29,9.78 | 22.99,8.76 23.11,8.64 | 22.99,8.76 22.86,8.64 | v23.75,9.91 23.11,9.91 | 23.11,9.91 22.99,9.91 | 23.11,9.91 22.99,10.03 | 23.11,9.91 22.99,9.78
  Bottom 0.305: J4.4 1.65,13.83 2.16,13.33 2.16,13.21 | 23.24,13.34 23.88,13.97 23.88,13.99 24.12,14.23 | 24.12,14.23 J6.6 | 23.75,14.61 24.12,14.23
INT2  (via drill 0.25 pad 0.51)
  Top 0.152: J2.6 v4.51,10.16 | J6.5 24,16.56 23.42,16.56 | 23.5,15.49 22.99,14.99 22.99,13.21 22.35,12.57 21.72,12.57 20.57,11.43 20.57,10.29 | U3.7 18.03,3.42 v18.16,3.56 | v21.21,5.33 21.21,7.37 20.19,8.38 v20.19,9.78 20.57,10.16 | J1.6 20.7,10.16 | 20.7,10.16 20.57,10.16 | 20.57,10.29 20.57,10.16 | 20.7,10.16 20.57,10.29
  Top 0.305: 23.5,15.49 23.75,15.75 23.75,16.31 24,16.56
  Bottom 0.152: J6.5 J6.2 | J4.5 J4.2 | 2.16,15.62 4.5,13.28 4.51,13.28 v4.51,10.16 4.51,10.1 4.95,9.65 20.07,9.65 v20.19,9.78 | v18.16,3.56 18.16,4.83 18.67,5.33 v21.21,5.33
  Bottom 0.305: 2.16,15.62 2.16,15.63 J4.5 | J6.5 24.1,16.51 24.05,16.56 23.55,16.56
IRQ
  Top 0.152: U3.13 14.36,3.92 14.1,4.19 U1.25
N$1
  Top 0.305: U1.10 12.1,13.43 11.94,13.59 10.92,13.59 10.54,13.21 10.54,12.65 10.08,12.19 9.02,12.19 8.83,12.38 R9.1 8.83,13.72 C15.1
N$2
  Top 0.254: R9.2 9.72,13.84 C14.2 9.97,14.1 12.19,14.1 12.6,13.69 U1.9
N$5
  Top 0.305: L2.1 C3.1 C5.1
N$6
  Top 0.305: C4.1 12.83,18.35 C2.2 14.15,18.35 arc45 15.04,18.72 L1.1
N$9
  Top 0.305: R4.2 9.78,18.35 C6.1 10.86,18.29 C4.2
N$10
  Top 0.305: R6.1 9.65,16.83 9.68,16.86 R5.2 C8.2 C5.2
N$11
  Top 0.305: R4.1 7.96,18.41 ANT.2 7.7,18.59 7.29,19 arc45 ANT.3 arc45 5.92,19 5.5,18.59 ANT.4
N$12
  Top 0.305: R5.1 6.8,16.89 ANT.1
N$13
  Top 0.305: C15.2 8.7,15.75 R6.2
N$14
  Top 0.305: U1.14 10.3,10.91 10.03,11.18 8.38,11.18 8.02,10.82 X2.1 C24.2
N$15
  Top 0.305: U1.15 10.66,10.41 9.12,8.87 X2.3 9.08,8.66 C25.2
RSTOUT_N  (via drill 0.25 pad 0.51)
  Top 0.152: U1.26 14.6,6.23 v14.73,6.1 | U3.10 16.25,5.2 v16.38,5.33
  Bottom 0.152: v14.73,6.1 15.49,6.86 16.26,6.86 16.51,6.6 16.51,5.46 v16.38,5.33
RSTPD_N  (via drill 0.25 pad 0.51)
  Top 0.152: U1.38 17.93,11.41 18.41,10.92 | U3.9 16.75,4.81 v17.27,5.33 | R14.1 18.62,10.73 18.61,10.73 | 18.61,10.73 18.48,10.73 | 18.41,10.92 18.41,10.79 | 18.41,10.79 18.41,10.67 | 18.41,10.67 18.41,10.54 | 18.41,10.54 v18.41,6.86 | 18.48,10.73 18.41,10.67 | 18.48,10.73 18.41,10.79 | 18.61,10.73 18.41,10.92 | 18.61,10.73 18.41,10.54
  Bottom 0.152: v17.27,5.33 18.41,6.48 v18.41,6.86
SCL  (via drill 0.25 pad 0.51)
  Top 0.152: J2.3 2.02,11.06 2.29,10.79 2.29,9.27 v2.03,9.02 1.79,9.26 J2.9 | J1.9 23.63,11.06 22.91,10.34 22.91,9.42 | J1.3 23.08,9.26 | 23.07,9.26 22.92,9.26 22.91,9.27 | U3.4 16.75,1.54 16.89,1.4 18.16,1.4 18.8,2.03 18.8,4.45 v18.67,4.57 R7.1 | 23.24,4.32 22.91,4.65 v22.91,8.1 22.91,9.09 | 22.91,9.09 22.91,9.27 | 22.91,9.27 22.91,9.42 | 23.08,9.26 23.07,9.26 | 23.07,9.26 22.91,9.42 | 23.08,9.26 22.91,9.09
  Top 0.305: 23.24,4.32 23.82,3.73 J5.5
  Bottom 0.152: v18.67,4.57 22.99,4.57 23.24,4.32 | 1.91,4.45 2.54,5.08 2.54,6.73 2.03,7.24 v2.03,9.02 2.41,9.4 3.81,9.4 4.32,8.89 19.86,8.89 20.7,8.05 22.86,8.05 v22.91,8.1
  Bottom 0.305: 23.24,4.32 23.82,3.73 J5.5 J5.2 | 1.91,4.45 1.27,3.81 J3.5 J3.2
SCL/HSU_RX
  Top 0.152: U1.27 15.1,6.49 15.75,5.84 | 15.75,5.84 U3.11 | 15.95,5.84 15.75,5.84 | 15.95,5.84 15.77,5.66 | 15.95,5.84 19.11,5.84 R2.1
SDA  (via drill 0.25 pad 0.51)
  Top 0.152: 2.92,9.4 2.92,9.53 | 2.92,9.53 2.92,9.78 | 2.92,9.78 2.92,10.54 3.14,10.76 J2.4 | J2.8 3.14,9.56 | 3.08,9.56 2.96,9.56 2.92,9.53 | 3.14,9.56 2.92,9.78 | 3.14,9.56 3.08,9.56 | 3.08,9.56 2.92,9.4 | J1.4 22.16,9.56 | 22.26,9.56 22.32,9.56 22.35,9.53 | U3.3 16.25,1.27 16.51,1.02 18.41,1.02 19.43,2.03 v19.43,2.79 19.37,2.86 R3.1 | 22.35,9.4 v22.35,7.49 22.35,3.38 v22.15,3.17 | 22.35,9.4 22.35,9.53 | 22.35,9.53 22.35,9.65 | 22.35,9.65 22.35,10.54 22.13,10.76 J1.8 | 22.19,9.56 22.26,9.56 | 22.26,9.56 22.35,9.65 | 22.16,9.56 22.19,9.56 | 22.19,9.56 22.35,9.4 | 22.16,9.56 22.33,9.73 | 2.92,9.4 2.92,8.79 v2.82,8.69
  Bottom 0.152: v19.43,2.79 19.81,3.17 v22.15,3.17 22.61,3.17 23.5,2.29 | v22.35,7.49 20.83,7.49 19.81,8.51 3,8.51 v2.82,8.69 2.41,8.28 2.41,7.37 3.17,6.6 3.17,3.68 1.78,2.29
  Bottom 0.305: 23.5,2.29 24.15,1.63 J5.6 J5.1 | 1.78,2.29 1.27,1.78 J3.4 J3.3
SDA/HSU_TX  (via drill 0.25 pad 0.51)
  Top 0.152: U3.12 15.25,5.2 v15.24,5.21 | U1.28 15.6,6.75 v16,6.35 19.11,6.35 R1.1
  Bottom 0.152: v16,6.35 16,5.97 v15.24,5.21
SWD_CLK  (via drill 0.25 pad 0.51)
  Top 0.152: U3.14 13.97,3.42 v13.84,3.56
  Bottom 0.152: J7.3 12.7,2.41 | 12.7,2.41 12.83,2.54 | 12.83,2.54 v13.84,3.56 | 12.7,2.41 12.32,1.91 | 12.83,2.54 12.83,1.78
SWD_DIO  (via drill 0.25 pad 0.51)
  Top 0.152: U3.16 13.86,2.42 v13.84,2.41
  Bottom 0.152: J7.4 14.61,1.65 14.1,2.16 | 14.1,2.16 v13.84,2.41 | 14.1,2.16 14.86,2.03 | 14.1,2.16 14.35,1.4
TX_N
  Top 0.203: L1.2 16.64,18.72 17.28,18.08 arc45 17.57,17.96 17.83,17.96 arc-45 18.09,17.85 18.36,17.58 arc-45 18.54,17.13 18.54,16.45 arc-45 18.21,15.64 17.79,15.23 arc-45 17.27,15.01 16.62,15.01 arc45 15.61,14.59 15.53,14.52 arc45 15.37,14.12 15.37,14.01 arc-45 15.25,13.72 arc45 15.11,13.4 15.11,13.12 U1.4
TX_P
  Top 0.203: L2.2 16.69,16.89 17.3,17.5 arc-45 17.55,17.6 17.7,17.6 arc-45 17.93,17.5 18.07,17.37 arc-45 18.19,17.08 18.19,16.52 arc-45 17.91,15.85 17.62,15.56 arc-45 17.16,15.37 16.57,15.37 arc45 14.35,14.45 arc45 14.1,13.85 U1.6
VBAT  (via drill 0.25 pad 0.51)
  Top 0.305: J2.2 4.9,11.36 | 5.01,11.36 5.26,11.36 v5.33,11.43 | J1.10 22.3,11.36 v22.35,11.3 | U1.40 17.62,12.41 18.86,13.65 C20.2 20.32,13.65 R12.2 R12.1 21.27,13.14 v21.34,13.08 | 3.5,8.96 J2.10 4.25,8.96 4.45,8.76 | 4.9,11.36 5.21,11.05 | 4.9,11.36 5.01,11.36 | 5.01,11.36 5.21,11.56 | 4.45,8.76 4.76,8.45 | 4.45,8.76 4.45,8.26 | 4.45,8.76 4.95,8.76 | J1.2 21.46,8.96 | 21.46,8.96 21.01,8.96 v20.83,9.14 | v21.72,5.97 21.72,8.51 21.72,8.71 | 21.72,8.71 21.46,8.96 | 21.72,8.71 21.72,8.76 21.84,8.89
  Top 0.508: C10.2 3.56,6.48 | 3.56,6.48 3.43,6.48 2.92,6.48 | 2.92,6.48 1.72,6.48 J3.6 | 3.52,5.96 U2.3 U2.4 | 3.52,5.96 3.52,6.44 3.56,6.48 | 3.52,5.96 3.55,5.96 3.94,6.35 | 3.52,5.96 3.43,5.96 2.92,6.48
  Top 0.61: C10.2 3.87,6.92 | 3.87,6.92 3.87,7.56 4.76,8.45 5.33,9.02 v5.33,11.43 | 3.87,6.92 3.43,6.48
  Bottom 0.305: v21.34,13.08 20.83,12.57 20.83,11.68 | v20.83,9.14 20.83,10.79 | 20.83,10.79 20.83,10.92 | 20.83,10.92 20.83,11.18 20.83,11.3 | 20.83,11.3 20.83,11.56 | v22.35,11.3 21.21,11.3 | 21.21,11.3 20.83,11.3 | 21.21,11.3 20.83,11.68 | 21.21,11.3 20.83,10.92 | 20.83,11.68 20.83,11.56 | 20.83,11.56 20.45,11.18 20.83,10.79 | v21.72,5.97 21.78,6.03 J5.4 J5.3
  Bottom 0.508: 5.71,11.18 5.59,11.18 v5.33,11.43 v5.33,10.79 5.71,11.18 | 5.71,11.18 20.45,11.18 20.83,11.18
  Bottom 0.61: J3.6 J3.1

### Text on the board
bPlace: GND | GND | INT2 | INT2 | INT1 | INT1 | Xadow NFC v2 | 09/17/2015 | by Seeed Studio | www.seeedstudio.com | VCC | VCC | SCL | SCL | SDA | 3V3 | GND | SWCLK | SWIO | !RST | SDA